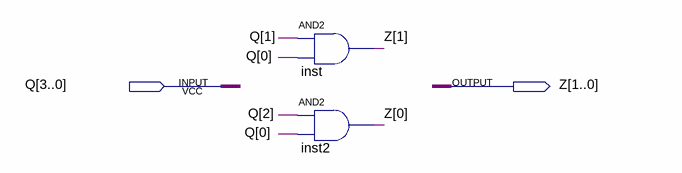
[diagram p0: schematic sheet]
// Quartus schematic 4to2Encoder.bdf as structural Verilog: 2 symbols, 2 pins
module \4to2Encoder  (
  input  [3:0] Q,
  output [1:0] Z
);

  and inst (Z[1], Q[1], Q[0]);
  and inst2 (Z[0], Q[2], Q[0]);
endmodule
